# Altium schematic sheet batteryMeasurement.SchDoc
size A4
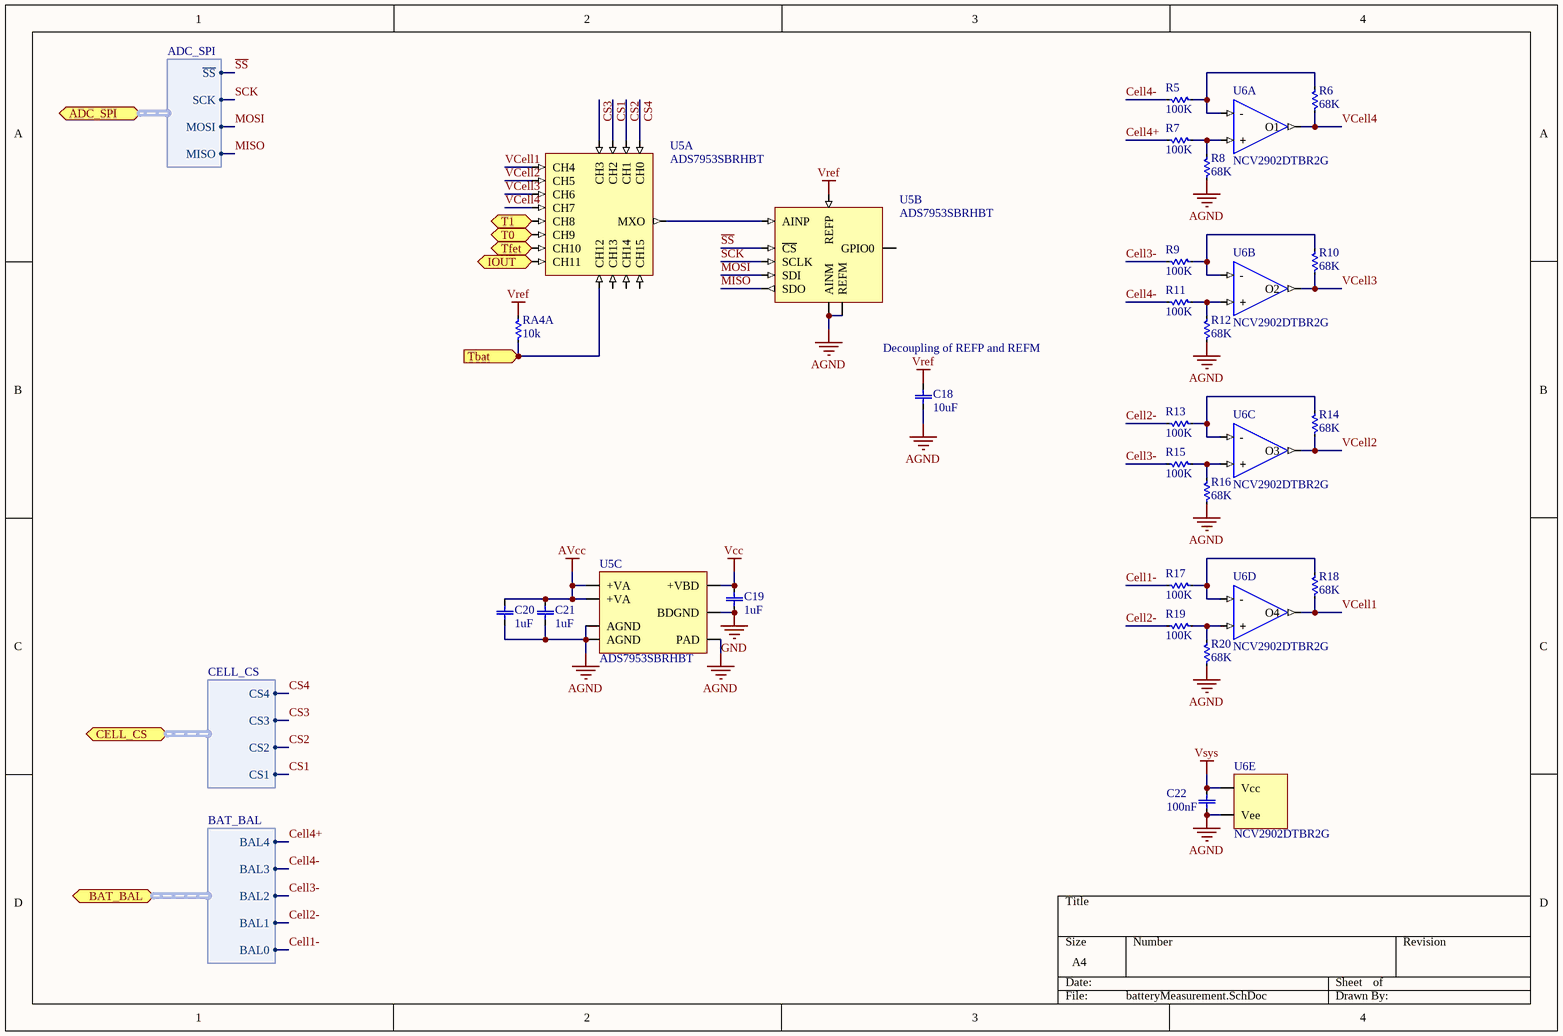
[diagram p0: batteryMeasurement.SchDoc]

## Parts
C18  10uF  [CAP0603]
C19  1uF  [CAP0603]
C20  1uF  [CAP0603]
C21  1uF  [CAP0603]
C22  100nF  [CAP0402]
R5  100K  [RES0402]
R6  68K  [RES0402]
R7  100K  [RES0402]
R8  68K  [RES0402]
R9  100K  [RES0402]
R10  68K  [RES0402]
R11  100K  [RES0402]
R12  68K  [RES0402]
R13  100K  [RES0402]
R14  68K  [RES0402]
R15  100K  [RES0402]
R16  68K  [RES0402]
R17  100K  [RES0402]
R18  68K  [RES0402]
R19  100K  [RES0402]
R20  68K  [RES0402]
RA4  Resistance: 10k  [CAC-50P200X100-8L]  (hidden comment: quad_resistor)  (part A of 4)
U5  ADS7953SBRHBT  [QFN50P500X500X100_HS-33L]  (parts A,B,C of 3)
U6  NCV2902DTBR2G  [TSOP65P640X120-14L]  (parts A,B,C,D,E of 5)

## Ports
ADC_SPI (harness ADC_SPI), BAT_BAL (harness BAT_BAL), CELL_CS (harness CELL_CS), IOUT (in), T0 (in), T1 (in), Tbat (in), Tfet (in)

## Harnesses
BAT_BAL: BAL0, BAL1, BAL2, BAL3, BAL4
CELL_CS: CS1, CS2, CS3, CS4
ADC_SPI: SCK, MOSI, MISO, ~{SS}

## Nets
AGND: C18.1 C20.1 C21.1 C22.2 R8.1 R12.1 R16.1 R20.1 U5.1(AGND) U5.4(AINM) U5.22(AGND) U5.30(REFM) U5.33(PAD) U6.11(Vee)
AVcc: C20.2 C21.2 U5.21(+VA) U5.32(+VA)
GND: C19.1 U5.27(BDGND)
Vcc: C19.2 U5.28(+VBD)
Vref: C18.2 RA4.1 U5.31(REFP)
Vsys: C22.1 U6.4(Vcc)
Cell1-: R17.2 ; port BAT_BAL.BAL0
Cell2-: R13.2 R19.2 ; port BAT_BAL.BAL1
Cell3-: R9.2 R15.2 ; port BAT_BAL.BAL2
Cell4+: R7.2 ; port BAT_BAL.BAL4
Cell4-: R5.2 R11.2 ; port BAT_BAL.BAL3
CS1: U5.18(CH2) ; port CELL_CS.CS1
CS2: U5.19(CH1) ; port CELL_CS.CS2
CS3: U5.17(CH3) ; port CELL_CS.CS3
CS4: U5.20(CH0) ; port CELL_CS.CS4
IOUT: U5.9(CH11) ; port IOUT
MISO: U5.26(SDO) ; port ADC_SPI.MISO
MOSI: U5.25(SDI) ; port ADC_SPI.MOSI
~{SS}: U5.23(~{CS}) ; port ADC_SPI.~{SS}
SCK: U5.24(SCLK) ; port ADC_SPI.SCK
T0: U5.11(CH9) ; port T0
T1: U5.12(CH8) ; port T1
Tbat: RA4.8 U5.8(CH12) ; port Tbat
Tfet: U5.10(CH10) ; port Tfet
VCell1: R18.1 U5.16(CH4) U6.14(O4)
VCell2: R14.1 U5.15(CH5) U6.8(O3)
VCell3: R10.1 U5.14(CH6) U6.7(O2)
VCell4: R6.1 U5.13(CH7) U6.1(O1)
NetR5_1: R5.1 R6.2 U6.2(-)
NetR7_1: R7.1 R8.2 U6.3(+)
NetR9_1: R9.1 R10.2 U6.6(-)
NetR11_1: R11.1 R12.2 U6.5(+)
NetR13_1: R13.1 R14.2 U6.9(-)
NetR15_1: R15.1 R16.2 U6.10(+)
NetR17_1: R17.1 R18.2 U6.13(-)
NetR19_1: R19.1 R20.2 U6.12(+)
NetU5_2: U5.2(MXO) U5.3(AINP)

Not connected (* = marked no-connect by the designer): U5 5(CH15) 6(CH14) 7(CH13) 29(GPIO0)

## Notes on the sheet
- Decoupling of REFP and REFM

## Library data of the parts
C18-C22 = capacitor
R5-R20 = resistor
U5 = ADS7953RHB: 12-Bit, 1 MSPS, 16-Channel, Single-Ended, MicroPower, Serial Interface ADC
U6 = QUAD_OPAMP